# Altium schematic sheet ADCs.SchDoc
size B; Organization: Midnight Sun Solar Rayce Car Team; Address1: University of Waterloo; Address2: 200 University Ave W; Address3: Waterloo, ON, Canada; Address4: N2L 3E9; Website: www.uwmidsun.com
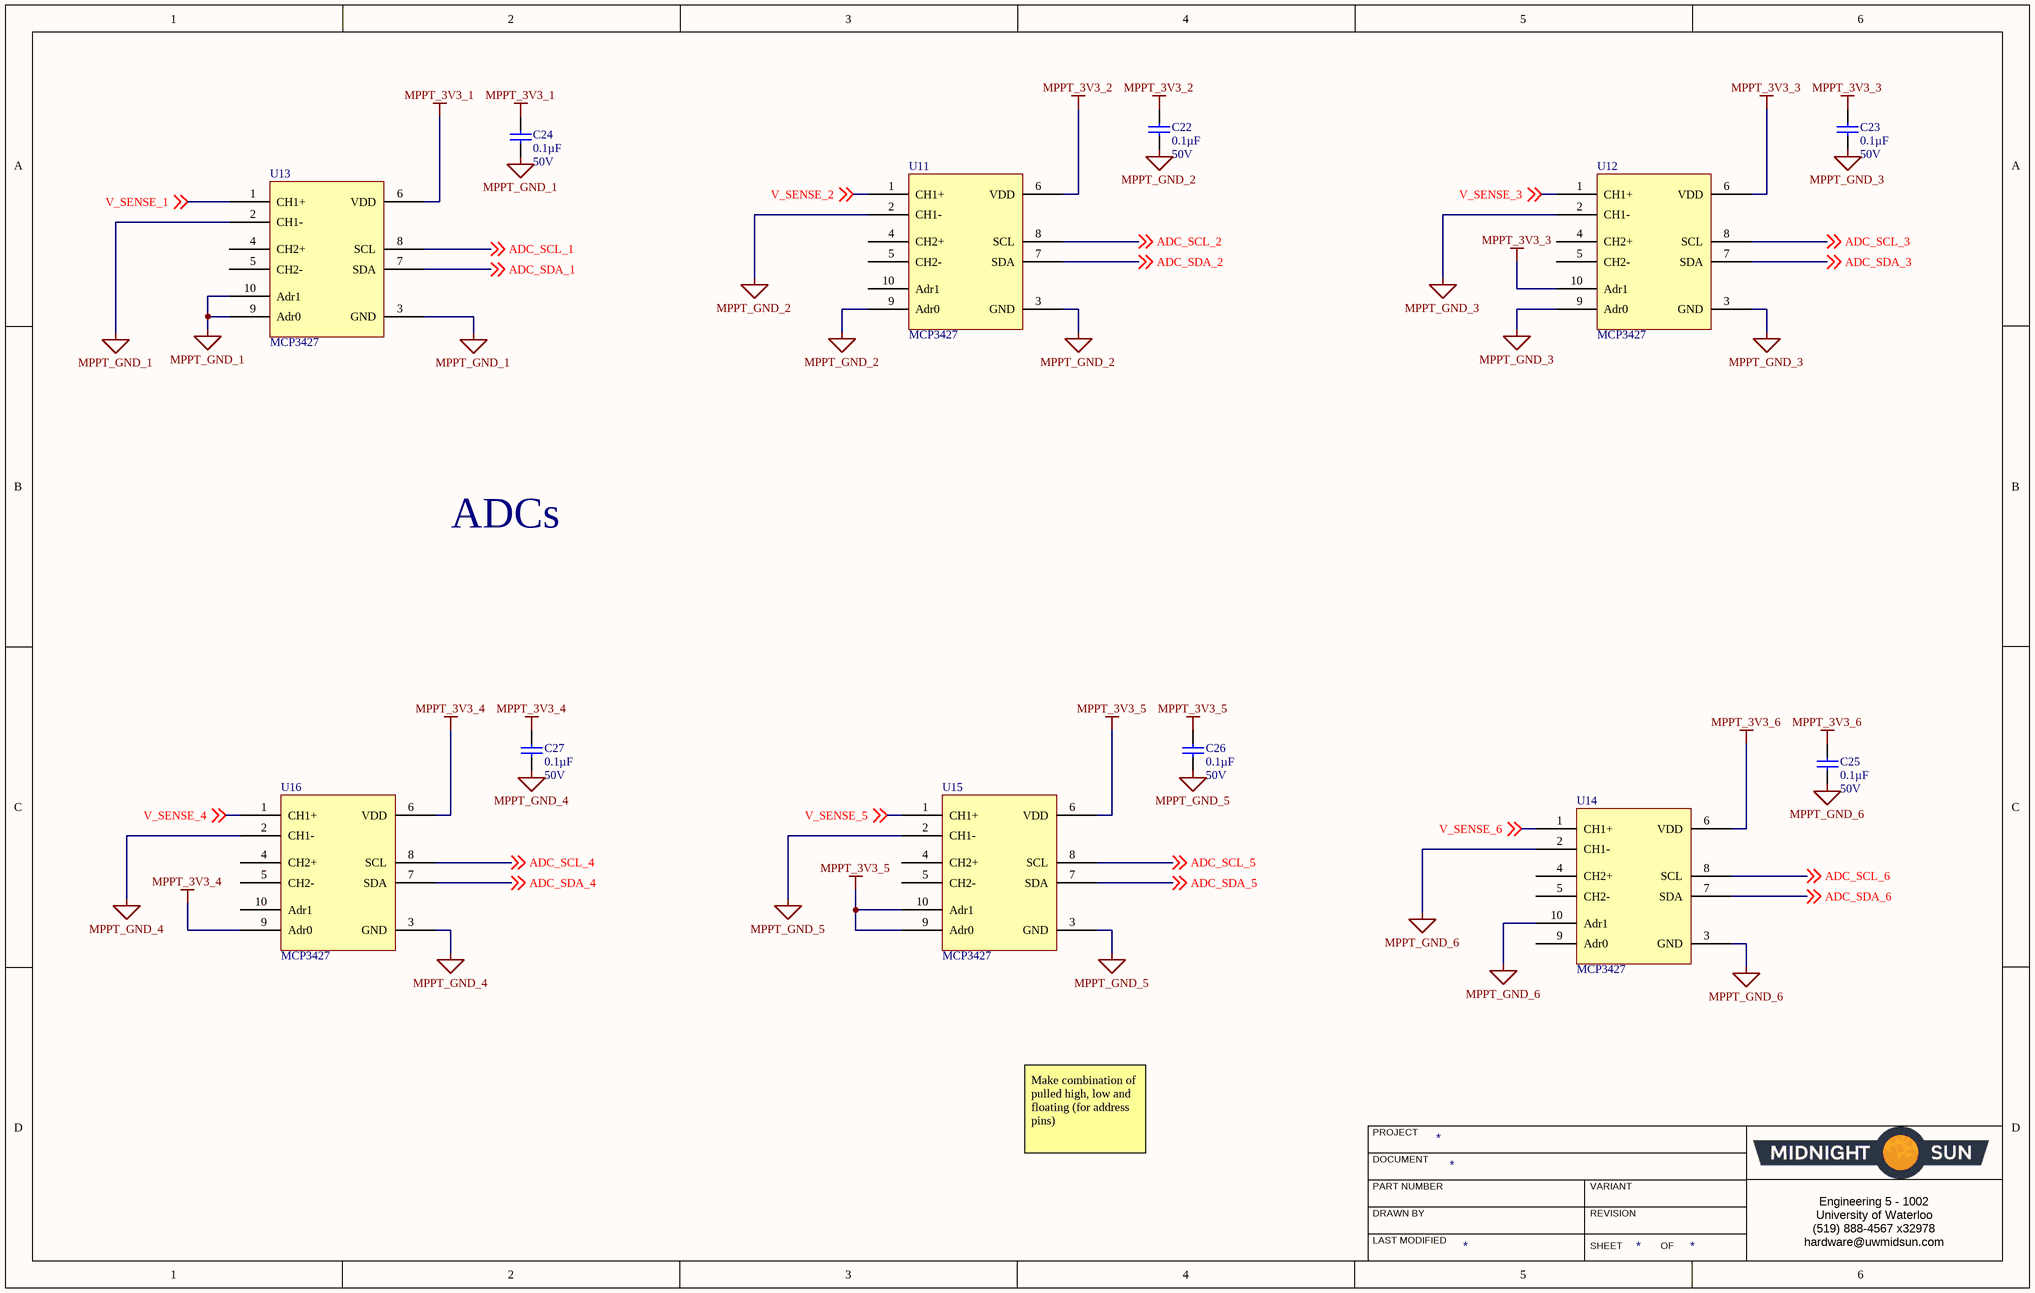
[diagram p0: ADCs.SchDoc]

## Parts
C22  Capacitance: 0.1µF  Voltage: 50V  [CAP, 0603]  (hidden comment: CAP CER 0.1UF 50V 10% X7R 0603)
C23  Capacitance: 0.1µF  Voltage: 50V  [CAP, 0603]  (hidden comment: CAP CER 0.1UF 50V 10% X7R 0603)
C24  Capacitance: 0.1µF  Voltage: 50V  [CAP, 0603]  (hidden comment: CAP CER 0.1UF 50V 10% X7R 0603)
C25  Capacitance: 0.1µF  Voltage: 50V  [CAP, 0603]  (hidden comment: CAP CER 0.1UF 50V 10% X7R 0603)
C26  Capacitance: 0.1µF  Voltage: 50V  [CAP, 0603]  (hidden comment: CAP CER 0.1UF 50V 10% X7R 0603)
C27  Capacitance: 0.1µF  Voltage: 50V  [CAP, 0603]  (hidden comment: CAP CER 0.1UF 50V 10% X7R 0603)
U11  Base Part Number: MCP3427  [IC ADC MCP3427]  (hidden comment: IC ADC MCP3427 10MSOP)
U12  Base Part Number: MCP3427  [IC ADC MCP3427]  (hidden comment: IC ADC MCP3427 10MSOP)
U13  Base Part Number: MCP3427  [IC ADC MCP3427]  (hidden comment: IC ADC MCP3427 10MSOP)
U14  Base Part Number: MCP3427  [IC ADC MCP3427]  (hidden comment: IC ADC MCP3427 10MSOP)
U15  Base Part Number: MCP3427  [IC ADC MCP3427]  (hidden comment: IC ADC MCP3427 10MSOP)
U16  Base Part Number: MCP3427  [IC ADC MCP3427]  (hidden comment: IC ADC MCP3427 10MSOP)

## Nets
MPPT_3V3_1: C24.1 U13.6(VDD)
MPPT_3V3_2: C22.1 U11.6(VDD)
MPPT_3V3_3: C23.1 U12.6(VDD) U12.10(Adr1)
MPPT_3V3_4: C27.1 U16.6(VDD) U16.9(Adr0)
MPPT_3V3_5: C26.1 U15.6(VDD) U15.9(Adr0) U15.10(Adr1)
MPPT_3V3_6: C25.1 U14.6(VDD)
MPPT_GND_1: C24.2 U13.2(CH1-) U13.3(GND) U13.9(Adr0) U13.10(Adr1)
MPPT_GND_2: C22.2 U11.2(CH1-) U11.3(GND) U11.9(Adr0)
MPPT_GND_3: C23.2 U12.2(CH1-) U12.3(GND) U12.9(Adr0)
MPPT_GND_4: C27.2 U16.2(CH1-) U16.3(GND)
MPPT_GND_5: C26.2 U15.2(CH1-) U15.3(GND)
MPPT_GND_6: C25.2 U14.2(CH1-) U14.3(GND) U14.10(Adr1)
ADC_SCL_1: U13.8(SCL) ; off-sheet ADC_SCL_1
ADC_SCL_2: U11.8(SCL) ; off-sheet ADC_SCL_2
ADC_SCL_3: U12.8(SCL) ; off-sheet ADC_SCL_3
ADC_SCL_4: U16.8(SCL) ; off-sheet ADC_SCL_4
ADC_SCL_5: U15.8(SCL) ; off-sheet ADC_SCL_5
ADC_SCL_6: U14.8(SCL) ; off-sheet ADC_SCL_6
ADC_SDA_1: U13.7(SDA) ; off-sheet ADC_SDA_1
ADC_SDA_2: U11.7(SDA) ; off-sheet ADC_SDA_2
ADC_SDA_3: U12.7(SDA) ; off-sheet ADC_SDA_3
ADC_SDA_4: U16.7(SDA) ; off-sheet ADC_SDA_4
ADC_SDA_5: U15.7(SDA) ; off-sheet ADC_SDA_5
ADC_SDA_6: U14.7(SDA) ; off-sheet ADC_SDA_6
V_SENSE_1: U13.1(CH1+) ; off-sheet V_SENSE_1
V_SENSE_2: U11.1(CH1+) ; off-sheet V_SENSE_2
V_SENSE_3: U12.1(CH1+) ; off-sheet V_SENSE_3
V_SENSE_4: U16.1(CH1+) ; off-sheet V_SENSE_4
V_SENSE_5: U15.1(CH1+) ; off-sheet V_SENSE_5
V_SENSE_6: U14.1(CH1+) ; off-sheet V_SENSE_6

Not connected (* = marked no-connect by the designer): U11 4(CH2+) 5(CH2-) 10(Adr1); U12 4(CH2+) 5(CH2-); U13 4(CH2+) 5(CH2-); U14 4(CH2+) 5(CH2-) 9(Adr0); U15 4(CH2+) 5(CH2-); U16 4(CH2+) 5(CH2-) 10(Adr1)

## Notes on the sheet
- ADCs
- Make combination of pulled high, low and floating (for address pins)
- PROJECT
- DOCUMENT
- DRAWN BY
- LAST MODIFIED
- PART NUMBER
- REVISION
- SHEET
- VARIANT
- OF
- Engineering 5 - 1002
  University of Waterloo
  (519) 888-4567 x32978
  hardware@uwmidsun.com

## Library data of the parts
C22-C27 = CAP CER 0.1UF 50V 10% X7R 0603: 0.10µF ±10% 50V Ceramic Capacitor X7R 0603 (1608 Metric); Manufacturer 1: AVX Corporation; Manufacturer Part Number 1: 06035C104KAT2A; Supplier 1: Digi-Key; Supplier Part Number 1: 478-5052-1-ND; Packaging: Cut Tape (CT); Part Status: Active; Operating Temperature: -55°C ~ 125°C; Ratings: -; Mounting Type: Surface Mount, MLCC; Package / Case: 0603 (1608 Metric); Size / Dimension: 0.063" L x 0.032" W (1.60mm x 0.81mm); Height - Seated (Max): -; Thickness (Max): 0.035" (0.90mm); Lead Spacing: -; Lead Style: -; ComponentLink1URL: http://datasheets.avx.com/X7RDielectric.pdf; ComponentLink1Description: http://datasheets.avx.com/X7RDielectric.pdf; Tolerance: ±10%; Temperature Coefficient: X7R
U11-U16 = IC ADC MCP3427 10MSOP: 16 Bit Analog to Digital Converter 2 Input 1 Sigma-Delta 10-MSOP; Manufacturer: Microchip Technology; Manufacturer Part Number: MCP3427-E/UN; Number of Bits: 16; Sampling Rate (Per Second): 15; Number of Inputs: 2; Input Type: Differential; Data Interface: I²C; Configuration: MUX-PGA-ADC; Reference Type: Internal; Voltage - Supply, Analog: 2.7 V ~ 5.5 V; Supplier 1: Digi-Key; RoHS: RoHS Compliant; Category: Integrated Circuits (ICs); Stock 1: 3001; Pricing 1: 1=4.32, 25=3.6064, 100=3.2704 (CAD); Packaging: Tube; Part Status: Active; Ratio - S/H:ADC: -; Architecture: Sigma-Delta; Voltage - Supply, Digital: 2.7 V ~ 5.5 V; Features: PGA, Selectable Address; Operating Temperature: -40°C ~ 125°C; Package / Case: 10-TFSOP, 10-MSOP (0.118", 3.00mm Width); Supplier Device Package: 10-MSOP; ComponentLink1URL: http://www.microchip.com/mymicrochip/filehandler.aspx?ddocname=en546216; ComponentLink1Description: http://www.microchip.com/mymicrochip/filehandler.aspx?ddocname=en546216; Supplier Part Number 1: MCP3427-E/UN-ND